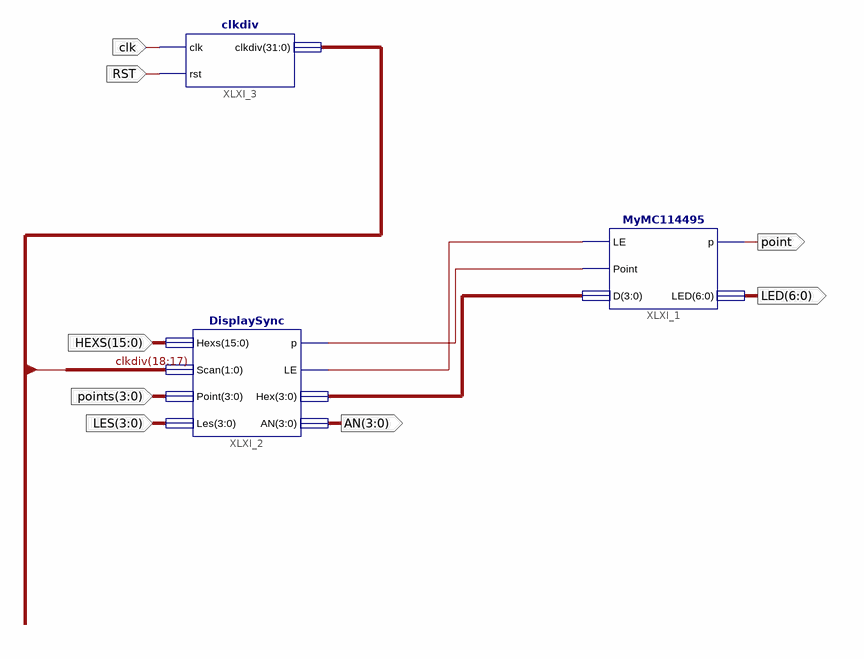
[diagram p0: schematic sheet 1]
// Xilinx ISE schematic DispNum.sch (kintex7) as structural Verilog: 3 symbols, 8 ports
module DispNum (
  input  clk,
  input  RST,
  input  [15:0] HEXS,
  input  [3:0] points,
  input  [3:0] LES,
  output [3:0] AN,
  output point,
  output [6:0] LED
);

  wire XLXN_8, XLXN_9;
  wire [3:0] XLXN_10;
  wire [31:0] clkdiv;

  MyMC114495 XLXI_1 (.LE(XLXN_9), .Point(XLXN_8), .D(XLXN_10), .p(point), .LED(LED));
  DisplaySync XLXI_2 (
    .Hexs(HEXS), .Scan(clkdiv[18:17]), .Point(points), .Les(LES), .p(XLXN_8), .LE(XLXN_9), .Hex(XLXN_10),
    .AN(AN));
  clkdiv XLXI_3 (.clk(clk), .rst(RST), .clkdiv(clkdiv));
endmodule
